# Altium schematic sheet comm.SchDoc
size A4
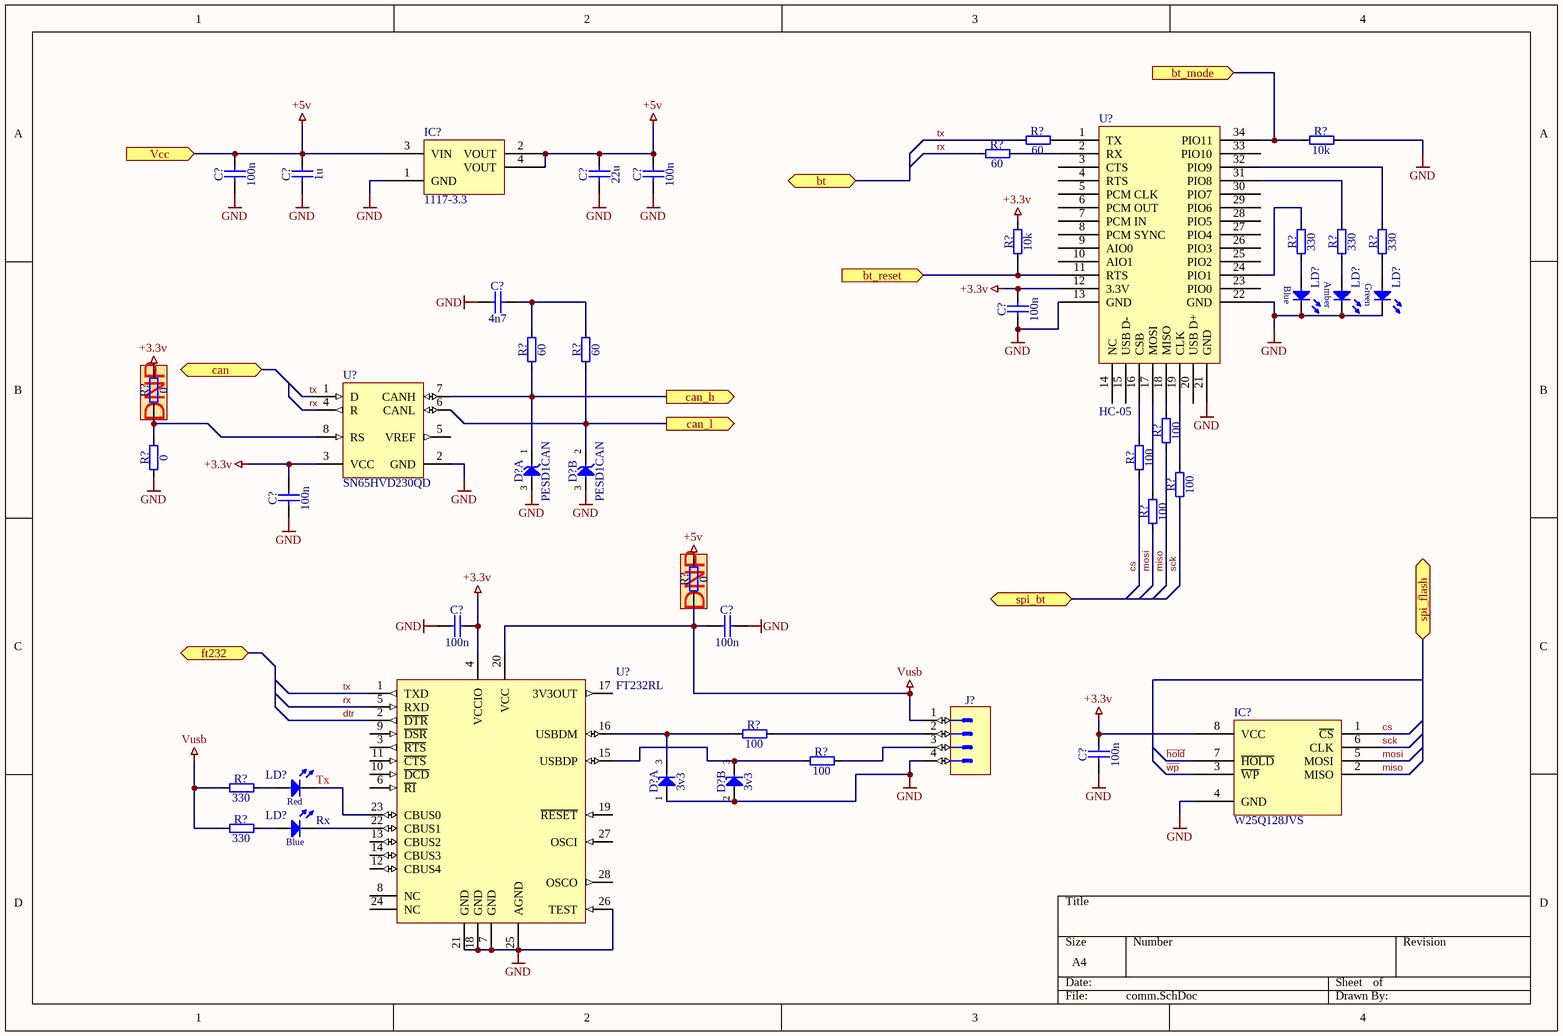
[diagram p0: comm.SchDoc]

## Parts
(Parts that share a designator on the sheet are numbered #1, #2 ... from top to bottom, then left to right.)
C?#1  100n
C?#2  1u
C?#3  22u
C?#4  100n
C?#5  4n7
C?#6  100n
C?#7  100n
C?#8  100n
C?#9  100n
C?#10  100n
D?#1  PESD1CAN  (part A of 2)
D?#2  PESD1CAN  (part B of 2)
D?#3  3v3  (part A of 2)
D?#4  3v3  (part B of 2)
IC?#1  1117-3.3
IC?#2  W25Q128JVS
J?  (no value)
LD?#1  (no value)
LD?#2  (no value)
LD?#3  (no value)
LD?#4  (no value)
LD?#5  (no value)
R?#1  60
R?#2  10k
R?#3  60
R?#4  10k
R?#5  330
R?#6  330
R?#7  330
R?#8  60
R?#9  60
R?#10  0
R?#11  100
R?#12  0
R?#13  100
R?#14  100
R?#15  100
R?#16  0
R?#17  100
R?#18  100
R?#19  330
R?#20  330
U?#1  HC-05  [HC-05]
U?#2  SN65HVD230QD  [D8_N]
U?#3  FT232RL  [SSOP-28_N]

## Ports
bt (bidir), bt_mode (in), bt_reset (in), can (bidir), can_h (out), can_l (out), ft232 (bidir), spi_bt (bidir), spi_flash (bidir), Vcc (in)

## Nets
+3.3v: C?#6.2 C?#7.2 C?#8.2 C?#10.2 IC?#2.8(VCC) R?#4.2 R?#10.2 U?#1.12(3.3V) U?#2.3(VCC) U?#3.4(VCCIO)
+5v: C?#1.2 C?#2.2 C?#3.2 C?#4.2 IC?#1.2(VOUT) IC?#1.3(VIN) IC?#1.4(VOUT) R?#16.2 ; port Vcc
GND: C?#1.1 C?#2.1 C?#3.1 C?#4.1 C?#5.1 C?#6.1 C?#7.1 C?#8.1 C?#9.1 C?#10.1 D?#1.3(COMA) D?#2.3(COMA) D?#3.1(A) D?#4.2(A) IC?#1.1(GND) IC?#2.4(GND) J?.4 LD?#1.1(C) LD?#2.1(C) LD?#3.1(C) R?#2.2 R?#12.1 U?#1.13(GND) U?#1.21(GND) U?#1.22(GND) U?#2.2(GND) U?#3.7(GND) U?#3.18(GND) U?#3.21(GND) U?#3.25(AGND) U?#3.26(TEST)
Vusb: C?#9.2 J?.1 R?#16.1 R?#19.1 R?#20.1 U?#3.20(VCC)
bt_mode: R?#2.1 U?#1.34(PIO11) ; port bt_mode
bt_reset: R?#4.1 U?#1.11(RTS) ; port bt_reset
can_h: D?#1.1(C) R?#8.1 U?#2.7(CANH) ; port can_h
can_l: D?#2.2(C) R?#9.1 U?#2.6(CANL) ; port can_l
cs: IC?#2.1(~{CS}) R?#13.1
dtr: U?#3.2(~{DTR})
~{hold}: IC?#2.7(~{HOLD})
miso: IC?#2.2(MISO) R?#11.1
mosi: IC?#2.5(MOSI) R?#15.1
rx: R?#3.1 U?#2.4(R) U?#3.5(RXD)
sck: IC?#2.6(CLK) R?#14.1
tx: R?#1.1 U?#2.1(D) U?#3.1(TXD)
~{wp}: IC?#2.3(~{WP})
NetC?#5_2: C?#5.2 R?#8.2 R?#9.2
NetD?#3_3: D?#3.3(COMC) R?#17.1 U?#3.16(USBDM)
NetD?#4_3: D?#4.3(COMC) R?#18.1 U?#3.15(USBDP)
NetJ?_2: J?.2 R?#17.2
NetJ?_3: J?.3 R?#18.2
NetLD?#1_2: LD?#1.2(A) R?#5.1
NetLD?#2_2: LD?#2.2(A) R?#6.1
NetLD?#3_2: LD?#3.2(A) R?#7.1
NetLD?#4_1: LD?#4.1(C) U?#3.23(CBUS0)
NetLD?#4_2: LD?#4.2(A) R?#19.2
NetLD?#5_1: LD?#5.1(C) U?#3.22(CBUS1)
NetLD?#5_2: LD?#5.2(A) R?#20.2
NetR?#1_2: R?#1.2 U?#1.1(TX)
NetR?#3_2: R?#3.2 U?#1.2(RX)
NetR?#5_2: R?#5.2 U?#1.24(PIO1)
NetR?#6_2: R?#6.2 U?#1.31(PIO8)
NetR?#7_2: R?#7.2 U?#1.32(PIO9)
NetR?#10_1: R?#10.1 R?#12.2 U?#2.8(RS)
NetR?#11_2: R?#11.2 U?#1.18(MISO)
NetR?#13_2: R?#13.2 U?#1.16(CSB)
NetR?#14_2: R?#14.2 U?#1.19(CLK)
NetR?#15_2: R?#15.2 U?#1.17(MOSI)

Not connected (* = marked no-connect by the designer): U?#1 3(CTS) 4(RTS) 5(PCM_CLK) 6(PCM_OUT) 7(PCM_IN) 8(PCM_SYNC) 9(AIO0) 10(AIO1) 14(NC) 15(USB_D-) 20(USB_D+) 23(PIO0) 25(PIO2) 26(PIO3) 27(PIO4) 28(PIO5) 29(PIO6) 30(PIO7) 33(PIO10); U?#2 5(VREF); U?#3 3(~{RTS}) 6(~{RI}) 8(NC) 9(~{DSR}) 10(~{DCD}) 11(~{CTS}) 12(CBUS4) 13(CBUS2) 14(CBUS3) 17(3V3OUT) 19(~{RESET}) 24(NC) 27(OSCI) 28(OSCO)

## Notes on the sheet
- (near R?#10) DNP
- (near R?#16) DNP
- (near LD?#4) Tx
- (near LD?#5) Rx
- (in symbol LED Amber 1C 2A) Amber
- (in symbol LED Blue 1C 2A) Blue
- (in symbol LED Green 1C 2A) Green
- (in symbol LED Red 1C 2A) Red

## Library data of the parts
C?#1-C?#10 = Capacitor - non polarized: Non-polarised capacitor
  C?#1 C?#4 C?#6-C?#10: Value: 100n
  C?#2: Value: 1u
  C?#3: Value: 22u
  C?#5: Value: 4n7
D?#1 D?#2 = Diode TVS Uni-Directionnal x2 C1A3_C2A3: Dual Common Anode TVS; Device: PESD1CAN
D?#3 D?#4 = Diode ESD x2 A1C3_A2C3: Dual Common Cathode ESD Protection Diodes; Device: 3v3
IC?#1 = ON Semi NCP1117: 1.0A Low-Dropout Positive Fixed and Adjustable Voltage Regulators
IC?#2 = MICROCHIP FLASH SPI 8PIN: Part Number: W25Q128JVS
J? = Connector 4 Male
LD?#1 LD?#5 = LED Blue 1C 2A
LD?#2 = LED Amber 1C 2A
LD?#3 = LED Green 1C 2A
LD?#4 = LED Red 1C 2A
R?#1-R?#20 = Resistor
  R?#1 R?#3 R?#8 R?#9: Value: 60
  R?#2 R?#4: Value: 10k
  R?#5-R?#7 R?#19 R?#20: Value: 330
  R?#10 R?#16: Value: 0
  R?#11 R?#13-R?#15 R?#17 R?#18: Value: 100
  R?#12: Parameter 1: *; Value: 0
U?#2 = SN65HVD230QD: Automotive Catalog 3.3 V CAN Transceiver, 17 mA, -40 to 125 degC, 8-pin SOIC (D), Green (RoHS & no Sb/Br); Manufacturer: Texas Instruments; Transient Pulse Protection(V): -25 to 25; Supply Voltage(s)(V): 3.3; Drivers Per Package: 1; ICC(Max)(mA): 17; ComponentLink1Description: Datasheet; PartNumber: SN65HVD230QD; Rating: Catalog; Mounting Technology: Surface Mount; DatasheetVersion: SLOS346K; ComponentLink1URL: http://www.ti.com/lit/ds/symlink/sn65hvd230.pdf; Isolated: No; Eco-Plan: Green (RoHS & no Sb/Br); Receivers Per Package: 1; Footprint: PCA82C250; PackageVersion: revM, Jun-2011; SubFamily: CAN; PackageDescription: 8-Pin Plastic Small Outline Integrated Circuit, 4.9 x 3.9 mm, Pitch 1.27 mm Pitch; Code_JEDEC: MS-012AA; PackageReference: D8
U?#3 = FT232RL-Reel: USB UART Asynchronous Serial Data Transfer Chip, SSOP-28, Tape and Reel; Published: 19-Aug-2010; DatasheetVersion: ver 2.07, Jul-2010; PackageVersion: 2010; PackageReference: SSOP-28; Publisher: Altium Limited; PackageDescription: 28-Pin Small Outline Package 0.65 mm Pitch; ComponentLink1Description: Manufacturer Link; ComponentLink1URL: http://www.ftdichip.com/Products/ICs/FT232R.htm; ComponentLink2Description: Datasheet; ComponentLink2URL: http://www.ftdichip.com/Support/Documents/DataSheets/ICs/DS_FT232R.pdf